# Altium project CHILD_BOARD.PrjPcb
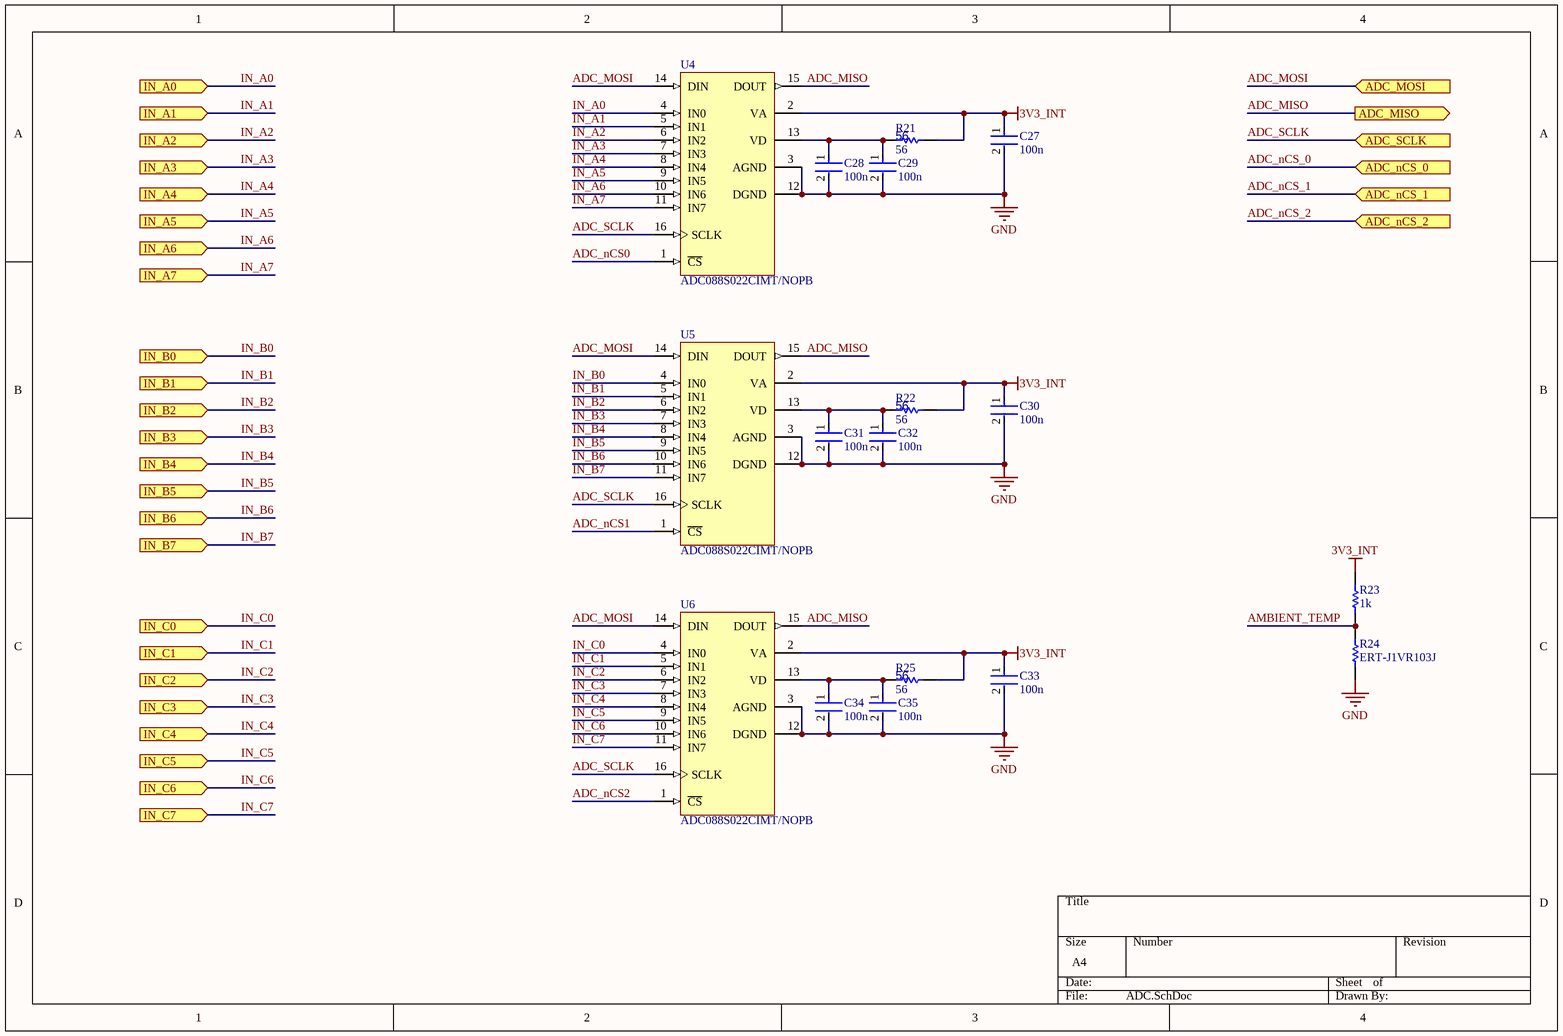
[diagram p0: ADC.SchDoc]
4 sheets, 87 parts. Net scope: flat (ports and power ports of the same name join across sheets).
Board file: CHILD_BOARD_revA.PcbDoc
Sheets:
  ADC.SchDoc
  TCAN1146_PWR_MGMT.SchDoc
  LM74910H_PINOUT.SchDoc
  JETSON_RAW_PWR_FILTER.SchDoc

## Sheet ADC.SchDoc
size A4; SheetNumber: 5; SheetTotal: 11

### Parts
C27  100n  [FP-0402-L_1_0_0_05-W_0_5-IPC_A]
C28  100n  [FP-0402-L_1_0_0_05-W_0_5-IPC_A]
C29  100n  [FP-0402-L_1_0_0_05-W_0_5-IPC_A]
C30  100n  [FP-0402-L_1_0_0_05-W_0_5-IPC_A]
C31  100n  [FP-0402-L_1_0_0_05-W_0_5-IPC_A]
C32  100n  [FP-0402-L_1_0_0_05-W_0_5-IPC_A]
C33  100n  [FP-0402-L_1_0_0_05-W_0_5-IPC_A]
C34  100n  [FP-0402-L_1_0_0_05-W_0_5-IPC_A]
C35  100n  [FP-0402-L_1_0_0_05-W_0_5-IPC_A]
R21  56  [R0603B]
R22  56  [R0603B]
R23  1k  [R0603B]
R24  ERT-J1VR103J  [RESC1608X90X30ML15T20]
R25  56  [R0603B]
U4  ADC088S022CIMT/NOPB  [MTC16_L]
U5  ADC088S022CIMT/NOPB  [MTC16_L]
U6  ADC088S022CIMT/NOPB  [MTC16_L]

### Ports
ADC_MISO (out, see CHILD_BOARD[5A]), ADC_MOSI (in, see CHILD_BOARD[5A]), ADC_nCS_0 (in), ADC_nCS_1 (in, see CHILD_BOARD[5A]), ADC_nCS_2 (in, see CHILD_BOARD[5A]), ADC_SCLK (in, see CHILD_BOARD[5A]), IN_A0 (in), IN_A1 (in), IN_A2 (in), IN_A3 (in), IN_A4 (in), IN_A5 (in), IN_A6 (in), IN_A7 (in), IN_B0 (in), IN_B1 (in), IN_B2 (in), IN_B3 (in), IN_B4 (in), IN_B5 (in), IN_B6 (in), IN_B7 (in), IN_C0 (in), IN_C1 (in), IN_C2 (in), IN_C3 (in), IN_C4 (in), IN_C5 (in), IN_C6 (in), IN_C7 (in)

### Nets
3V3_INT: C27.1 C30.1 C33.1 R21.1 R22.1 R23.2 R25.1 U4.2(VA) U5.2(VA) U6.2(VA)
GND: C27.2 C28.2 C29.2 C30.2 C31.2 C32.2 C33.2 C34.2 C35.2 R24.1 U4.3(AGND) U4.12(DGND) U5.3(AGND) U5.12(DGND) U6.3(AGND) U6.12(DGND)
ADC_MISO: U4.15(DOUT) U5.15(DOUT) U6.15(DOUT) ; port ADC_MISO
ADC_MOSI: U4.14(DIN) U5.14(DIN) U6.14(DIN) ; port ADC_MOSI
ADC_nCS0: U4.1(~{CS})
ADC_nCS1: U5.1(~{CS})
ADC_nCS2: U6.1(~{CS})
ADC_nCS_0: port ADC_nCS_0
ADC_nCS_1: port ADC_nCS_1
ADC_nCS_2: port ADC_nCS_2
ADC_SCLK: U4.16(SCLK) U5.16(SCLK) U6.16(SCLK) ; port ADC_SCLK
AMBIENT_TEMP: R23.1 R24.2
IN_A0: U4.4(IN0) ; port IN_A0
IN_A1: U4.5(IN1) ; port IN_A1
IN_A2: U4.6(IN2) ; port IN_A2
IN_A3: U4.7(IN3) ; port IN_A3
IN_A4: U4.8(IN4) ; port IN_A4
IN_A5: U4.9(IN5) ; port IN_A5
IN_A6: U4.10(IN6) ; port IN_A6
IN_A7: U4.11(IN7) ; port IN_A7
IN_B0: U5.4(IN0) ; port IN_B0
IN_B1: U5.5(IN1) ; port IN_B1
IN_B2: U5.6(IN2) ; port IN_B2
IN_B3: U5.7(IN3) ; port IN_B3
IN_B4: U5.8(IN4) ; port IN_B4
IN_B5: U5.9(IN5) ; port IN_B5
IN_B6: U5.10(IN6) ; port IN_B6
IN_B7: U5.11(IN7) ; port IN_B7
IN_C0: U6.4(IN0) ; port IN_C0
IN_C1: U6.5(IN1) ; port IN_C1
IN_C2: U6.6(IN2) ; port IN_C2
IN_C3: U6.7(IN3) ; port IN_C3
IN_C4: U6.8(IN4) ; port IN_C4
IN_C5: U6.9(IN5) ; port IN_C5
IN_C6: U6.10(IN6) ; port IN_C6
IN_C7: U6.11(IN7) ; port IN_C7
NetC28_1: C28.1 C29.1 R21.2 U4.13(VD)
NetC31_1: C31.1 C32.1 R22.2 U5.13(VD)
NetC34_1: C34.1 C35.1 R25.2 U6.13(VD)

### Library data of the parts
C27-C35 = CMP-001-00058-1: LARGE PADS, 0402 CAP, CHANGE COMMENT TO MATCH REAL P/N; Capacitor Type: Ceramic; Min Operating Temperature: -55°C; Mounting Technology: Surface Mount; Pins: 2; Case/Package: 0402; RoHS Compliant: Yes; Max Operating Temperature: 85°C
R21-R23 R25 = CMP-009-00002-14: Resistor
  R21 R22 R25: Value: 56
  R23: Value: 1k
R24 = CMP-2000-00869-1: Manufacturer: Panasonic; Part Number: ERT-J1VR103J
U4-U6 = CMP-0054-00372-2: 8-Channel, 50 kSPS to 200 kSPS, 8-Bit A/D Converter, 16-pin TSSOP, Pb-Free; Manufacturer: National Semiconductor; PackageTopMarking: NSUZXYTT*88S022*CIMT; CompType: ADC IC; PowerWise: Y; ComponentLink2URL: http://www.national.com/pf/AD/ADC088S022.html; RoHS: Y; PackageDescription: Molded TSSOP, Jedec, 5 x 4.4 x 0.9mm Body, 16 Lead, 0.65mm Pitch; DatasheetVersion: Feb-2010; PinCount: 16; ComponentLink1Description: ADC088S022 Datasheet; Code_JEDEC: MO-153-AB; ComponentLink3URL: http://www.national.com/packaging/folders/mtc16.html; PackageVersion: revD, Jun-2003; ComponentLink3Description: MTC16 Package Page; RevisionNote: Component URLs added; ComponentLink1URL: http://www.national.com/ds/AD/ADC088S022.pdf; ComponentLink2Description: ADC088S022 Web Page; PackageReference: MTC16

## Sheet TCAN1146_PWR_MGMT.SchDoc
size C; SheetNumber: 7; SheetTotal: 11
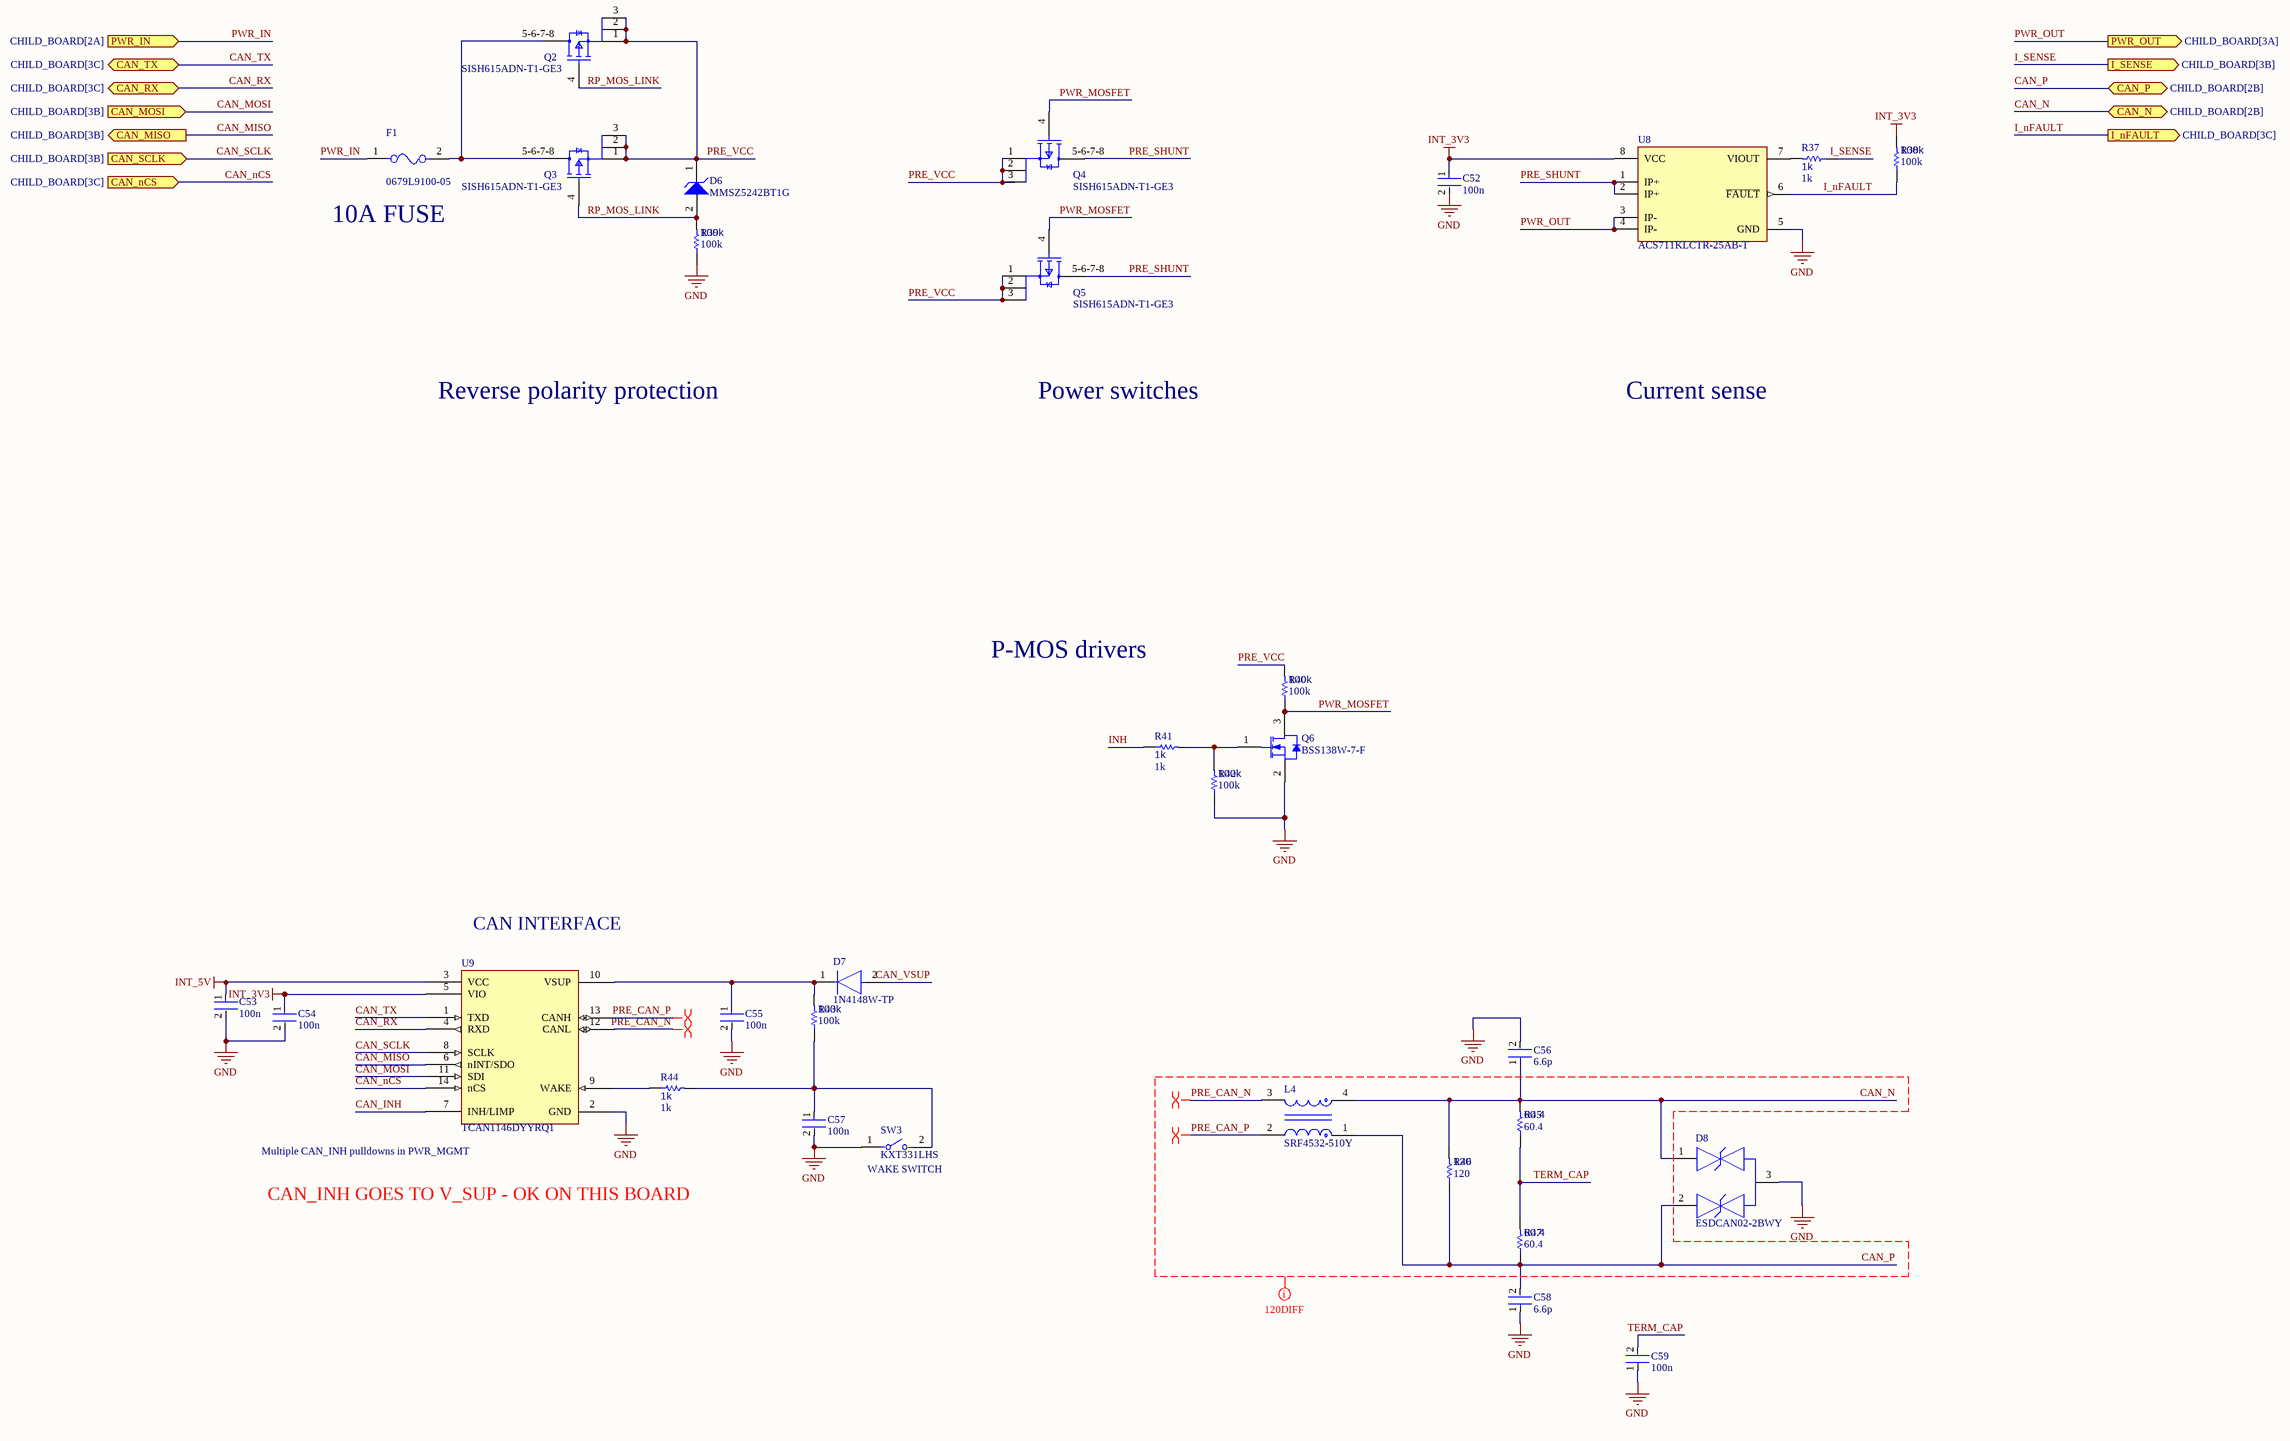
[diagram p1: TCAN1146_PWR_MGMT.SchDoc]

### Parts
C52  100n  [FP-0402-L_1_0_0_05-W_0_5-IPC_A]
C53  100n  [FP-0402-L_1_0_0_05-W_0_5-IPC_A]
C54  100n  [FP-0402-L_1_0_0_05-W_0_5-IPC_A]
C55  100n  [FP-0402-L_1_0_0_05-W_0_5-IPC_A]
C56  6.6p  [FP-0402-L_1_0_0_05-W_0_5-IPC_A]
C57  100n  [FP-0402-L_1_0_0_05-W_0_5-IPC_A]
C58  6.6p  [FP-0402-L_1_0_0_05-W_0_5-IPC_A]
C59  100n  [FP-0402-L_1_0_0_05-W_0_5-IPC_A]
D6  MMSZ5242BT1G  [ONSC-SOD-123-2-425-04_V]
D7  1N4148W-TP  [FP-SOD-123-IPC_A]
D8  ESDCAN02-2BWY  [FP-SOT323-3L-MFG]
F1  0679L9100-05  [FP-0679L-MFG]
L4  SRF4532-510Y  [FP-SRF4532-MFG]
Q2  SISH615ADN-T1-GE3  [SISH615ADN-T1-GE3-Footprint-1]
Q3  SISH615ADN-T1-GE3  [SISH615ADN-T1-GE3-Footprint-1]
Q4  SISH615ADN-T1-GE3  [SISH615ADN-T1-GE3-Footprint-1]
Q5  SISH615ADN-T1-GE3  [SISH615ADN-T1-GE3-Footprint-1]
Q6  BSS138W-7-F  [DIOD-SOT323-3_V]
R37  1k  [R0603B]
R38  100k  [R0603B]
R39  100k  [R0603B]
R40  100k  [R0603B]
R41  1k  [R0603B]
R42  100k  [R0603B]
R43  100k  [R0603B]
R44  1k  [R0603B]
R45  60.4  [R0603B]
R46  120  [R0603B]
R47  60.4  [R0603B]
SW3  KXT331LHS  [FP-KXT331LHS-MFG]
U8  ACS711KLCTR-25AB-T  [FP-LC-8-IPC_A]
U9  TCAN1146DYYRQ1  [TCAN1146DYYRQ1-Footprint-1]

### Ports
CAN_MISO (out, see CHILD_BOARD[3B]), CAN_MOSI (in, see CHILD_BOARD[3B]), CAN_N (bidir, see CHILD_BOARD[2B]), CAN_nCS (in, see CHILD_BOARD[3C]), CAN_P (bidir, see CHILD_BOARD[2B]), CAN_RX (bidir, see CHILD_BOARD[3C]), CAN_SCLK (in, see CHILD_BOARD[3B]), CAN_TX (bidir, see CHILD_BOARD[3C]), I_nFAULT (out, see CHILD_BOARD[3C]), I_SENSE (out, see CHILD_BOARD[3B]), PWR_IN (in, see CHILD_BOARD[2A]), PWR_OUT (out, see CHILD_BOARD[3A])

### Nets
GND: C52.2 C53.2 C54.2 C55.2 C56.2 C57.2 C58.1 C59.1 D8.3 Q6.2(S) R39.1 R42.1 SW3.1 U8.5(GND) U9.2(GND)
INT_3V3: C52.1 C54.1 R38.2 U8.8(VCC) U9.5(VIO)
INT_5V: C53.1 U9.3(VCC)
CAN_INH: U9.7(INH/LIMP)
CAN_MISO: U9.6(nINT/SDO) ; port CAN_MISO
CAN_MOSI: U9.11(SDI) ; port CAN_MOSI
CAN_N: C56.1 D8.1 L4.4 R45.2 R46.2 ; port CAN_N
CAN_nCS: U9.14(nCS) ; port CAN_nCS
CAN_P: C58.2 D8.2 L4.1 R46.1 R47.1 ; port CAN_P
CAN_RX: U9.4(RXD) ; port CAN_RX
CAN_SCLK: U9.8(SCLK) ; port CAN_SCLK
CAN_TX: U9.1(TXD) ; port CAN_TX
CAN_VSUP: D7.2(A)
I_nFAULT: R38.1 U8.6(~{FAULT}) ; port I_nFAULT
I_SENSE: R37.1 ; port I_SENSE
INH: R41.1
PRE_CAN_N: L4.3 U9.12(CANL)
PRE_CAN_P: L4.2 U9.13(CANH)
PRE_SHUNT: Q4.5-6-7-8(D) Q5.5-6-7-8(D) U8.1(IP+) U8.2(IP+)
PRE_VCC: D6.1(K) Q2.1(S) Q2.2(S) Q2.3(S) Q3.1(S) Q3.2(S) Q3.3(S) Q4.1(S) Q4.2(S) Q4.3(S) Q5.1(S) Q5.2(S) Q5.3(S) R40.2
PWR_IN: F1.1 ; port PWR_IN
PWR_MOSFET: Q4.4(G) Q5.4(G) Q6.3(D) R40.1
PWR_OUT: U8.3(IP-) U8.4(IP-) ; port PWR_OUT
RP_MOS_LINK: D6.2(A) Q2.4(G) Q3.4(G) R39.2
TERM_CAP: C59.2 R45.1 R47.2
NetC55_1: C55.1 D7.1(C) R43.2 U9.10(VSUP)
NetC57_1: C57.1 R43.1 R44.2 SW3.2
NetF1_2: F1.2 Q2.5-6-7-8(D) Q3.5-6-7-8(D)
NetQ6_1: Q6.1(G) R41.2 R42.2
NetR37_2: R37.2 U8.7(VIOUT)
NetR44_1: R44.1 U9.9(WAKE)

### Layout directives
differential pair: PRE_CAN_N, PRE_CAN_P
net class 120DIFF: CAN_N, CAN_P, PRE_CAN_N, PRE_CAN_P, TERM_CAP

### Notes on the sheet
- (near F1) 10A FUSE
- Reverse polarity protection
- Power switches
- Current sense
- P-MOS drivers
- CAN INTERFACE
- (near U9) Multiple CAN_INH pulldowns in PWR_MGMT
- (near SW3) WAKE SWITCH
- CAN_INH GOES TO V_SUP - OK ON THIS BOARD

### Library data of the parts
C52-C59 = CMP-001-00058-1: as C27 on sheet ADC; Min Operating Temperature: -55°C; Mounting Technology: Surface Mount; Pins: 2; Case/Package: 0402; RoHS Compliant: Yes; Max Operating Temperature: 85°C
D6 = CMP-1060-00565-1: Zener Voltage Regulator, 500 mW, 2-Pin SOD-123, Pb-Free, Tape and Reel; Manufacturer: On Semiconductor; P Max (W): 0.5; VZ Typ (V): 12; PartNumber: MMSZ5242BT1G; PackageReference: SOD-123-2-425-04; ComponentLink3URL: http://www.onsemi.com/pub_link/Collateral/425-04.PDF; Mounting Technology: Surface Mount; ComponentLink2Description: Datasheet; ComponentLink1URL: http://www.onsemi.com/; ComponentLink3Description: Package Specification; PackageDescription: 2-Pin SOD, Body 1.6 x 2.69 mm; PackageVersion: Rev. G, 10/2009; ComponentLink1Description: Manufacturer URL; RoHS: Pb-Free; ComponentLink2URL: http://www.onsemi.com/pub_link/Collateral/MMSZ5221BT1-D.PDF; Packing: Tape and Reel; DatasheetVersion: Rev. 12
D7 = CMP-2000-04993-2: DIODE GEN PURP 100V 150MA SOD123; Max Reverse Leakage Current: 5uA; Max Surge Current: 2A; Reverse Recovery Time: 4ns; Polarity: Standard; Capacitance: 4pF; Max Forward Surge Current (Ifsm): 1A; Element Configuration: Single; Power Dissipation: 400mW; Forward Voltage: 1V; Radiation Hardening: No; Lead Free: Lead Free; Max Reverse Voltage (DC): 100V; Current Rating: 150mA; Forward Current: 150mA; Packaging: Tape and Reel; Number of Pins: 2; Package Quantity: 3000; Max Operating Temperature: 150°C; Min Operating Temperature: -65°C; Average Rectified Current: 150mA; Recovery Time: 4ns; Output Current: 150mA; Peak Non-Repetitive Surge Current: 2A; Width: 1.8mm; Voltage Rating (DC): 100V; Height: 1.2mm; Max Repetitive Reverse Voltage (Vrrm): 100V; Mount: Surface Mount; Length: 2.85mm
D8 = CMP-12225-000055-1: TVS DIODE 26.5V 44V SOT323-3; Manufacturer: STMicroelectronics; Value: 3pF; Direction: Bidirectional; Breakdown Voltage: 28.5V; Automotive Grade: Grade 0; Standoff Height: 0mm; Peak Pulse Power: 170W; Peak Pulse Current: 3A; Number Of Channels: 2; Max Junction Temp: +175°C; Mouser Description: TVS Diodes / ESD Suppressors Automotive dual-line Transil, Transient voltage suppressor (TVS) for CAN bus; Height: 1.1mm; Category: Diode; Reverse Standoff Voltage: 26.5V; Device Class L1: Circuit Protection; Temperature: -55°C to +175°C; RoHS: TRUE; ComponentLink2URL: https://www.st.com/resource/en/datasheet/esdcan02-2bwy.pdf; Device Class L3: unset; Device Class L2: TVS Diodes; Temperature Range High: +175°C; Octopart: https://octopart.com/esdcan02-2bwy-stmicroelectronics-58631133; Ipc Land Pattern Name: SOT65P210X95-3; Temperature Range Low: -55°C; Capacitance: 3pF; Digikey Description: TVS DIODE 26.5V 44V SOT323-3; Automotive: Yes; ComponentLink2Description: Datasheet; Clamping Voltage: 44V; Manufacturer Part Number: ESDCAN02-2BWY; Lead Free: Yes; Package: SOT323-3L
F1 = CMP-16042-000002-1: DIFF P#!!! / FUSE BRD MNT 10A 125VAC/VDC; Manufacturer: Bel Fuse; Manufacturer Part Number: 0679L9150-01; Max Fuse Ac Voltage: 125V; Fuse Blow Speed: Fast; Fuse Current: 15A; Fuse I2T: 103.5A2Sec; Fuse Interrupt Ac Current: 50A; Automotive Grade: Grade 1; Value: 0.0038Ω; Fuse Interrupt Dc Current: 300A; Fuse Voltage Drop: 0.13V; Device Class L2: Fuses; ComponentLink2URL: https://www.belfuse.com/resources/CircuitProtection/datasheets/0679L%20Sep2016.pdf; Package: 0679L; Height: 2.79mm; Digikey Description: FUSE BRD MNT 15A 125VAC/VDC; Temperature Range High: +125°C; Device Class L3: unset; Octopart: https://octopart.com/0679l9150-01-bel+fuse-70850665; Temperature Range Low: -55°C; Max Fuse Dc Voltage: 125V; Ipc Land Pattern Name: CAPC610254X254; Category: Fuse; Lead Free: Yes; Automotive: Yes; Resistance: 0.0038Ω; RoHS: TRUE; Device Class L1: Circuit Protection; ComponentLink2Description: Datasheet; Temperature: -55°C to +125°C; Voltage Rating: 125V
L4 = CMP-07251-000006-1: CMC 51UH 200MA 2LN 2KOHM SMD; Element Configuration: Dual; Number of Lines: 2; Core Material: Ferrite; Impedance: 2kR; Test Frequency: 100kHz; Voltage Rating (DC): 50V; Insulation Resistance: 10MR; Material: Steel; Tolerance: 50%; DC Resistance (DCR): 3.5R; RoHS Compliant: Yes; Mount: Surface Mount; REACH SVHC: No SVHC; Termination: SMD/SMT; DC Current: 200mA; Current: 200mA; Lead Free: Lead Free; Contact Plating: Tin; Length: 4.5mm; Max DC Current: 200mA; Width: 0.126inch; Case/Package: 4532; Packaging: Tape and Reel; Package Quantity: 1; Min Operating Temperature: -40°C; Depth: 3.4mm; Series: SRF4532; Max Operating Temperature: 125°C; Current Rating: 200mA; Self Resonant Frequency: 100kHz; Height: 0.118inch; Inductance: 51uH; Resistance: 2kR
Q2-Q5 = CMP-013-00018-2: Trans MOSFET P-CH 20V 22.1A 8-Pin PowerPAK 1212 EP T/R; Source: SISH615ADN-T1-GE3.SchLib; Design Item ID: CMP-013-00036-4; Component Type: Standard; Pins: 5
Q6 = CMP-2000-05968-1: N-Channel Enhancement Mode Mosfet, 50 V, 200 mA, -55 to 150 degC, 6-Pin SOT-323, RoHS, Tape and Reel; Typical Turn-Off Delay Time: 20ns; Number of Channels: 1Channel; Type: EnhancementModeFieldEffectTransistor; Brand: DiodesIncorporated; Vds - Drain-Source Breakdown Voltage: 75V; Vgs - Gate-Source Voltage: 20V; Rds On - Drain-Source Resistance: 1.4Ohms; Transistor Type: 1N-Channel; Configuration: Single; Unit Weight: 0.000212oz; Pd - Power Dissipation: 200mW; Id - Continuous Drain Current: 200mA; Forward Transconductance - Min: 0.1S; Manufacturer URL: http://www.diodes.com/; Series: BSS138; Package Description: 3-Pin Small Outline Transistor, Body 2 x 1.25 mm, Pitch 0.65 mm; Mounting Technology: SurfaceMount; Product Category: MOSFET; RoHS: True; Maximum Operating Temperature: +150C; Height: 1mm; Length: 2.2mm; Technology: Si; Width: 1.35mm; Datasheet URL: http://www.diodes.com/_files/datasheets/ds30206.pdf; Manufacturer: DiodesIncorporated; Package / Case: SOT-323-3; Typical Turn-On Delay Time: 20ns; Transistor Polarity: N-Channel; Factory Pack Quantity: 3000; Packaging: Reel; Product: MOSFETSmallSignal; Datasheet Version: Rev. 11-2, 09/2013; Package Reference: SOT323; Minimum Operating Temperature: -55C; Mounting Style: SMD/SMT; Channel Mode: Enhancement
R37-R47 = CMP-009-00002-14: Resistor
  R37 R41 R44: Value: 1k
  R38-R40 R42 R43: Value: 100k
  R45 R47: Value: 60.4
  R46: Value: 120
SW3 = CMP-10040-000029-1: SWITCH TACTILE SPST-NO 0.02A 15V; Operating Force: 240gf; Switch Travel: 0.13mm; Illumination Type: Non-Illuminated; Throw Configuration: SPST; Number of Ports: 1; Current Rating: 5A; Mechanical Life: 500000Cycles; Switch Function: Off-Mom; Connector Type: USB; Actuator Type: Standard; Gender: Receptacle; Number of Contacts: 24; Contact Plating: Gold; Insulation Color: Black; Min Operating Temperature: -40°C; Packaging: Tape and Reel; Flammability Rating: UL94 V-0; Max Operating Temperature: 85°C; Termination: Solder; Mount: Surface Mount
U8 = CMP-1557-00015-2: SENSOR CURRENT HALL 25A AC/DC; Bandwidth: 100kHz; Min Supply Voltage: 3V; Polarity: Bidirectional; Max Supply Voltage: 5.5V; Max Supply Current: 5.5mA; Number of Channels: 1; Quiescent Current: 4mA; Sensitivity: 55mV/A; Accuracy: 4%; Linearity: 1%; Operating Supply Voltage: 3.3V; Response Time: 4.6us; Case/Package: SOIC; Min Operating Temperature: -40°C; RoHS Compliant: Yes; Length: 4.9mm; Package Quantity: 1; Number of Pins: 8; Width: 3.9mm; REACH SVHC: No SVHC; -3db Bandwidth: 100kHz; Series: -; Packaging: Tape and Reel; Max Operating Temperature: 125°C; Current Sensing: 25A; Height: 1.5mm; Frequency: 100kHz
U9 = CMP-318-000000-2: Automotive CAN FD transceiver with watchdog, bus diagnostics and partial networking via sele 14-SOT-23-THIN -40 to 150; Component Type: Standard; Design Item ID: CMP-015-00012-2; Pin Count: 14; Source: TCAN1146DYYRQ1.SchLib

## Sheet LM74910H_PINOUT.SchDoc
size B; SheetNumber: 9; SheetTotal: 11
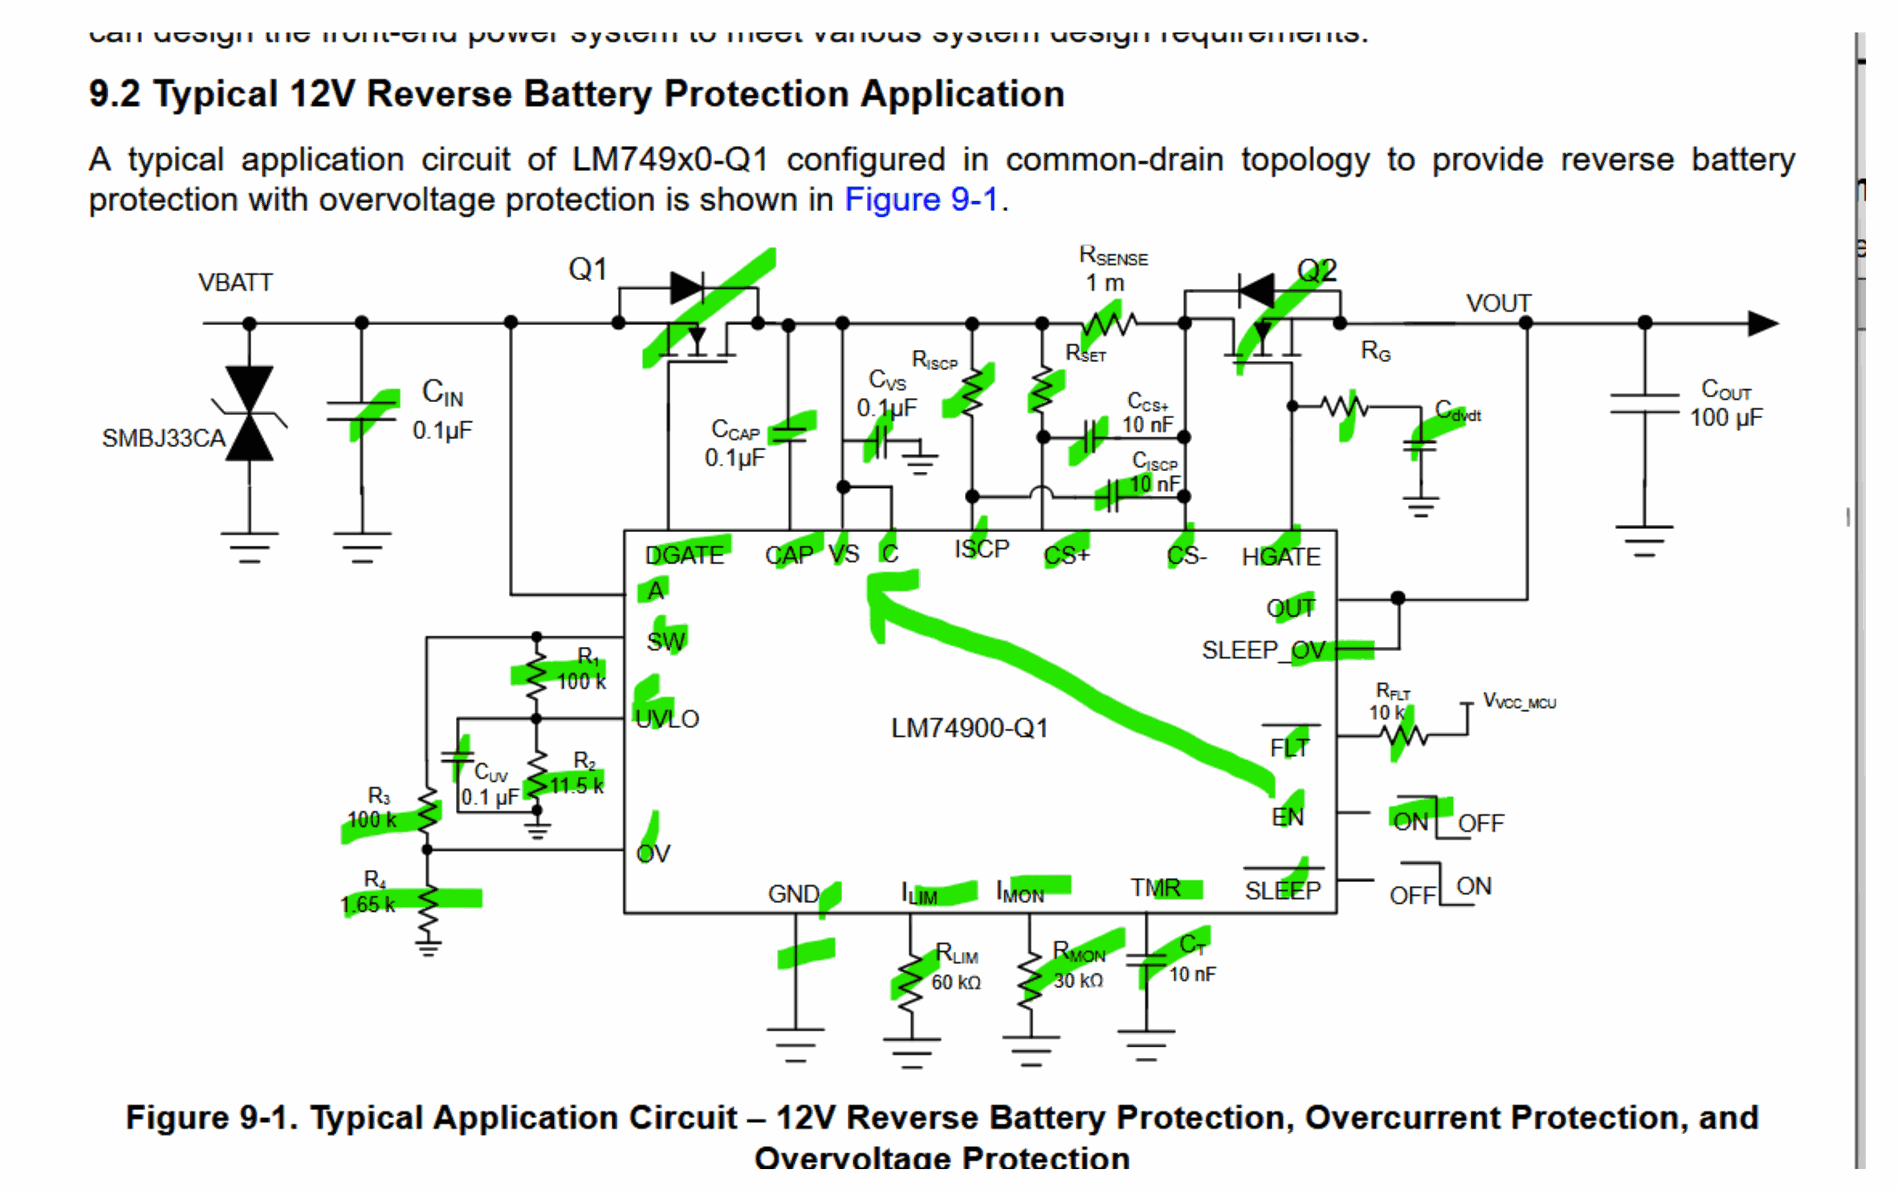
[diagram p2: LM74910H_PINOUT.SchDoc, top]
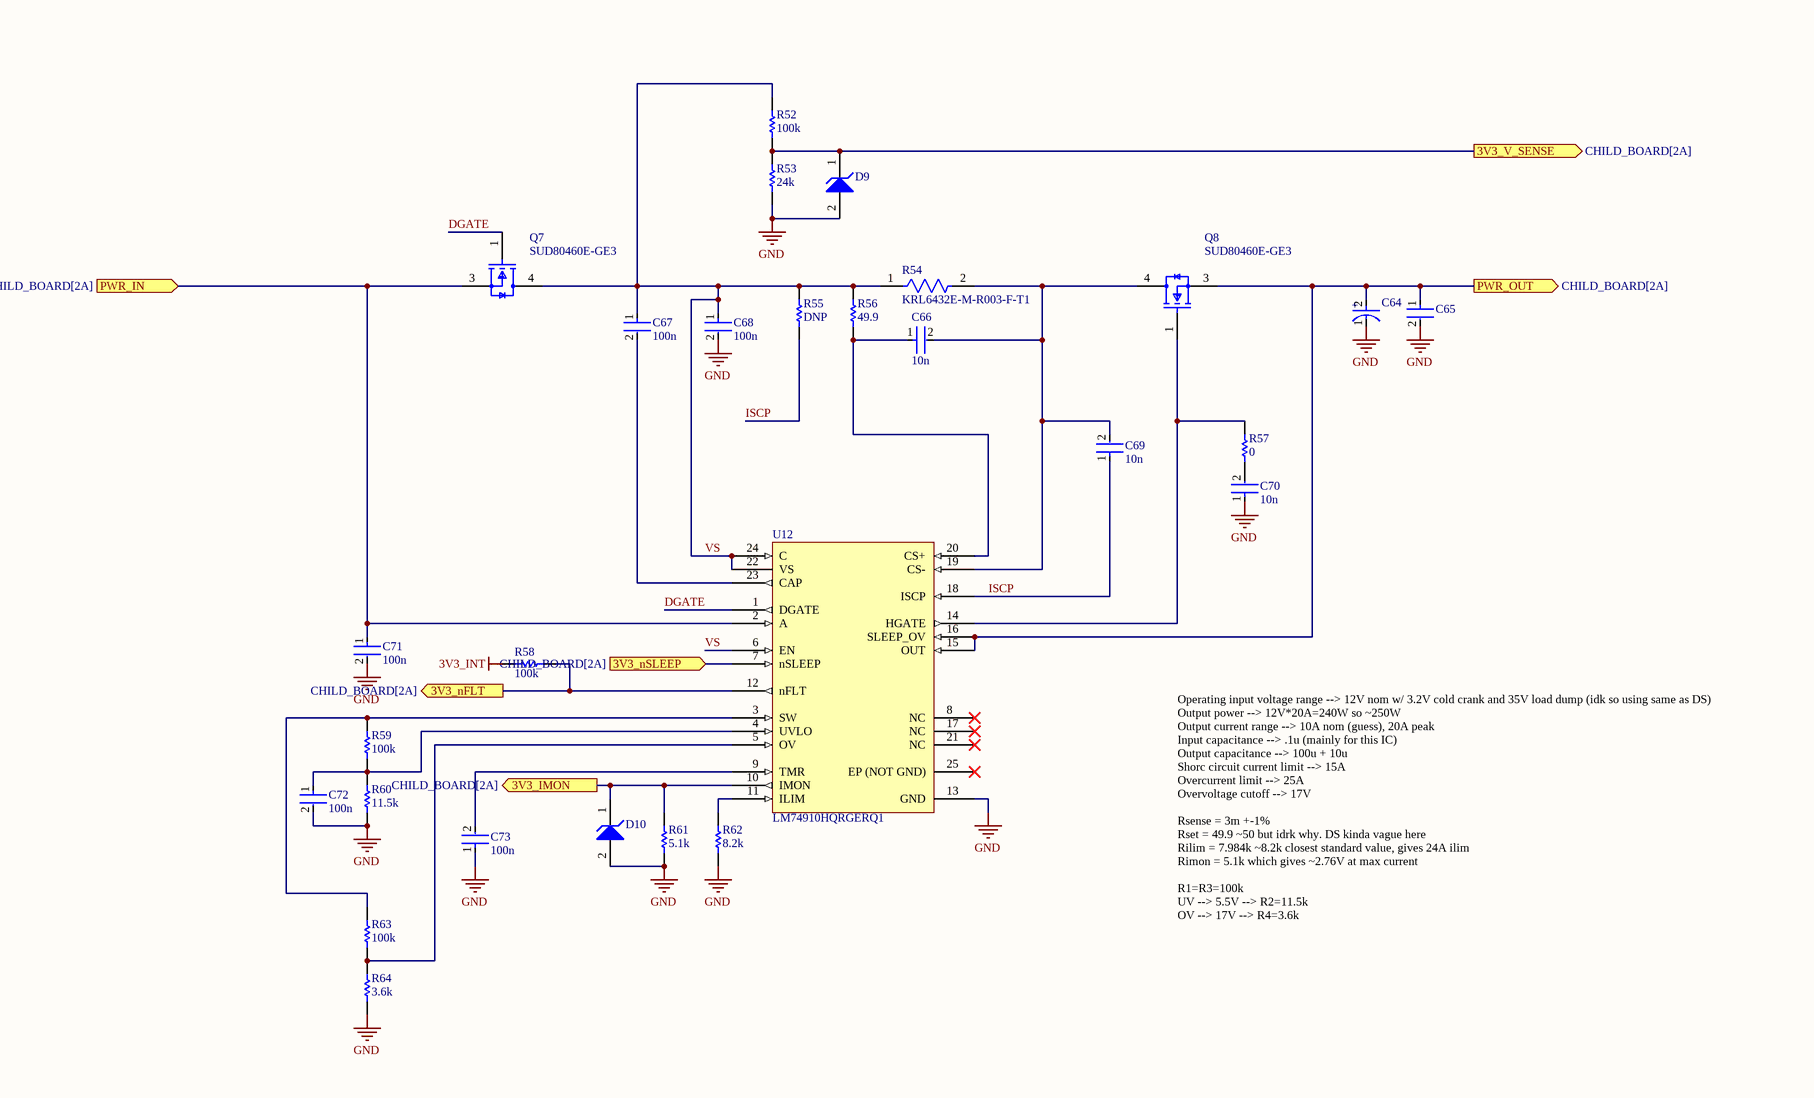
[diagram p3: LM74910H_PINOUT.SchDoc, bottom]

### Parts
C64  EEE-FK1H100UR  [FP-FKC-MFG]  (value not drawn)
C65  12103D106KAT2A  [FP-1210-L_3_3_0_4-W_2_5_0-MFG]  (value not drawn)
C66  10n  [FP-0402-L_1_0_0_05-W_0_5-IPC_A]
C67  100n  [FP-0402-L_1_0_0_05-W_0_5-IPC_A]
C68  100n  [FP-0402-L_1_0_0_05-W_0_5-IPC_A]
C69  10n  [FP-0402-L_1_0_0_05-W_0_5-IPC_A]
C70  10n  [FP-0402-L_1_0_0_05-W_0_5-IPC_A]
C71  100n  [FP-0402-L_1_0_0_05-W_0_5-IPC_A]
C72  100n  [FP-0402-L_1_0_0_05-W_0_5-IPC_A]
C73  100n  [FP-0402-L_1_0_0_05-W_0_5-IPC_A]
D9  DNP/MM5Z3V3T1G  [ONSC-SOD-523-2-502-01_V]  (value not drawn)
D10  DNP/MM5Z3V3T1G  [ONSC-SOD-523-2-502-01_V]  (value not drawn)
Q7  SUD80460E-GE3  [FP-T16-0236-MFG]
Q8  SUD80460E-GE3  [FP-T16-0236-MFG]
R52  100k  [R0603B]
R53  24k  [R0603B]
R54  KRL6432E-M-R003-F-T1  [FP-KRL6432E-MFG]
R55  DNP  [R0603B]
R56  49.9  [R0603B]
R57  0  [R0603B]
R58  100k  [R0603B]
R59  100k  [R0603B]
R60  11.5k  [R0603B]
R61  5.1k  [R0603B]
R62  8.2k  [R0603B]
R63  100k  [R0603B]
R64  3.6k  [R0603B]
U12  LM74910HQRGERQ1  [QFN50P400X400X100_HS-25N]

### Ports
3V3_IMON (out, see CHILD_BOARD[2A]), 3V3_nFLT (out, see CHILD_BOARD[2A]), 3V3_nSLEEP (in, see CHILD_BOARD[2A]), 3V3_V_SENSE (out, see CHILD_BOARD[2A]), PWR_IN (in, see CHILD_BOARD[2A]), PWR_OUT (out, see CHILD_BOARD[2A])

### Nets
3V3_INT: R58.2
GND: C64.1(C) C65.2 C68.2 C70.1 C71.2 C72.2 C73.1 D9.2(A) D10.2(A) R53.1 R60.1 R61.1 R62.1 R64.1 U12.13(GND)
DGATE: Q7.1(G) U12.1(DGATE)
ISCP: C69.1 R55.1 U12.18(ISCP)
PWR_IN: C71.1 Q7.3(S) U12.2(A) ; port PWR_IN
PWR_OUT: C64.2(A) C65.1 Q8.3(S) U12.15(OUT) U12.16(SLEEP_OV) ; port PWR_OUT
VS: C67.1 C68.1 Q7.4(D) R52.2 R54.1 R55.2 R56.2 U12.6(EN) U12.22(VS) U12.24(C)
NetC66_1: C66.1 R56.1 U12.20(CS+)
NetC66_2: C66.2 C69.2 Q8.4(D) R54.2 U12.19(CS-)
NetC67_2: C67.2 U12.23(CAP)
NetC70_2: C70.2 R57.1
NetC72_1: C72.1 R59.1 R60.2 U12.4(UVLO)
NetC73_2: C73.2 U12.9(TMR)
NetD9_1: D9.1(K) R52.1 R53.2 ; port 3V3_V_SENSE
NetD10_1: D10.1(K) R61.2 U12.10(IMON) ; port 3V3_IMON
NetQ8_1: Q8.1(G) R57.2 U12.14(HGATE)
NetR58_1: R58.1 U12.12(nFLT) ; port 3V3_nFLT
NetR59_2: R59.2 R63.2 U12.3(SW)
NetR62_2: R62.2 U12.11(ILIM)
NetR63_1: R63.1 R64.2 U12.5(OV)
NetU12_7: U12.7(nSLEEP) ; port 3V3_nSLEEP

Not connected (* = marked no-connect by the designer): U12 8(NC)* 17(NC)* 21(NC)* 25(EP_(NOT_GND))*

### Notes on the sheet
- Operating input voltage range --> 12V nom w/ 3.2V cold crank and 35V load dump (idk so using same as DS)
  Output power --> 12V*20A=240W so ~250W
  Output current range --> 10A nom (guess), 20A peak
  Input capacitance --> .1u (mainly for this IC)
  Output capacitance --> 100u + 10u
  Shorc circuit current limit --> 15A
  Overcurrent limit --> 25A
  Overvoltage cutoff --> 17V
  Rsense = 3m +-1%
  Rset = 49.9 ~50 but idrk why. DS kinda vague here
  Rilim = 7.984k ~8.2k closest standard value, gives 24A ilim
  Rimon = 5.1k which gives ~2.76V at max current
  R1=R3=100k
  UV --> 5.5V --> R2=11.5k
  OV --> 17V --> R4=3.6k
- (in symbol CMP-05427-000030-1) +

### Library data of the parts
C64 = CMP-05427-000030-1: CAP ALUM 10UF 20% 50V SMD; Impedance: 1.52R; Ripple Current (AC): 85mA; Life (Hours): 2000Hour; Leakage Current: 3uA; Dielectric Material: Aluminium; Length: 5.8mm; Voltage Rating: 50V; Radiation Hardening: No; Max Operating Temperature: 105°C; REACH SVHC: No SVHC; Tolerance: 20%; RoHS Compliant: Yes; Case/Package: Radial; Height: 5.8mm; Voltage: 50V; Diameter: 5mm; Number of Pins: 2; Ripple Current: 85mA; Series: FK; Lead Free: Lead Free; Width: 6.5mm; ESR (Equivalent Series Resistance): 1.52R; Package Quantity: 1000; Construction: Cylindrical; Voltage Rating (DC): 50V; Packaging: Tape and Reel; Height - Seated (Max): 0.228inch; Contact Plating: Tin; Capacitance: 10uF; Min Operating Temperature: -55°C; Termination: SMD/SMT; Material: Aluminium; Mount: Surface Mount
C65 = CMP-2000-05477-2: General Purpose Ceramic Capacitor, 1210, 10uF, 10%, X5R, 15%, 25V; Lead Free: Lead Free; Max Operating Temperature: 85°C; REACH SVHC: No SVHC; Depth: 2.5mm; Packaging: Tape and Reel; Min Operating Temperature: -55°C; Height: 2.29mm; Construction: Flat; Case Code (Imperial): 1210; Radiation Hardening: No; Voltage: 25V; Case/Package: 1210; Series: -; Dielectric: X5R; Length: 3.2mm; Thickness: 0.11inch; Package Quantity: 1; Termination: SMD/SMT; Case Code (Metric): 3225; Voltage Rating (DC): 25V; Voltage Rating: 25V; Contact Plating: Tin; RoHS Compliant: Yes; Mount: Surface Mount; Width: 0.098inch; Capacitance: 10uF; Tolerance: 10%
C66-C73 = CMP-001-00058-1: as C27 on sheet ADC; Min Operating Temperature: -55°C; Mounting Technology: Surface Mount; Pins: 2; Case/Package: 0402; RoHS Compliant: Yes; Max Operating Temperature: 85°C
D9 D10 = CMP-1060-00750-1: Zener Voltage Regulator, 500 mW, 2-Pin SOD-523, Pb-Free, Tape and Reel; Manufacturer: On Semiconductor; P Max (W): 0.5; VZ Typ (V): 3.3; RoHS: Pb-Free; ComponentLink2Description: Datasheet; PackageReference: SOD-523-2-502-01; DatasheetVersion: Rev. 10; ComponentLink1Description: Manufacturer URL; PackageVersion: Rev. E, 09/2010; ComponentLink3URL: http://www.onsemi.com/pub_link/Collateral/502-01.PDF; ComponentLink2URL: http://www.onsemi.cn/pub_link/Collateral/MM5Z2V4T1-D.PDF; Mounting Technology: Surface Mount; PartNumber: MM5Z3V3T1G; Packing: Tape and Reel; PackageDescription: 2-Pin SOD, Body 1.2 x 0.8 mm; ComponentLink1URL: http://www.onsemi.com/; ComponentLink3Description: Package Specification
Q7 Q8 = CMP-02550-000179-1: MOSFET N-CH 150V 42A TO252AA; Manufacturer: Vishay; Rthja Max: 50°C/W; Number Of N Channels: 1; Max Junction Temp: +175°C; Power Dissipation: 65.2W; Reverse Recovery Charge: 210nC; Reverse Recovery Time: 68ns; Threshold Vgs Max: 4V; Input Capacitace At Vds: 560pF @ 50V; Drain To Source Resistance: 0.0372Ω; Max Forward Diode Voltage: 1.5V; Gate Charge At Vgs: 10.5nC @ 10V; Threshold Vgs Min: 2V; Transconductance: 11S; Typ Forward Diode Voltage: 0.85V; Turn On Delay Time: 8ns; Turn Off Delay Time: 15ns; Gate To Source Voltage: 20V; Depletion Mode: False; Pulse Drain Current: 40A; Automotive: No; Drain To Source Voltage: 150V; ComponentLink2Description: Datasheet; Octopart: https://octopart.com/sud80460e-ge3-vishay-78440626; Device Class L2: Transistors; Lead Free: Yes; Device Class L3: MOSFETs; Temperature Range High: +175°C; Continuous Drain Current: 42A; Temperature: -55°C to +175°C; Footprint Url: https://www.vishay.com/docs/71197/to252aa.pdf; Manufacturer Part Number: SUD80460E-GE3; Package: T16-0236; ComponentLink2URL: https://www.vishay.com/docs/76248/sud80460e.pdf; Device Class L1: Discrete Semiconductors; Digikey Description: MOSFET N-CH 150V 42A TO252AA; Number Of Channels: 1; Category: Trans; Temperature Range Low: -55°C; Height: 2.507mm; RoHS: TRUE; Drain To Source Breakdown Voltage: 150V
R52 R53 R55-R64 = CMP-009-00002-14: Resistor
R54 = CMP-00597-24927456-1: KRL6432E-M-R003-F-T1 Metal Foil Low Resistance Chip Resistor (long-side terminal), 2512, RoHS; Tolerance: 1%; Resistance: 3mΩ; Temperature Coefficient: 50ppm/°C; Power Rating: 3W; Height: 700µm; NexarPartId: 24927456; Termination: SMD/SMT; Case Code (Metric): 6432; Min Operating Temperature: -55°C; Length: 3.1mm; Weight: 40.511469mg; Width: 6.3mm; Lifecycle Status: Production; Max Operating Temperature: 155°C; Case Code (Imperial): 2512; Composition: Metal Foil; Case/Package: 2512; Max Thickness: 700µm; RoHS: Compliant
U12 = CMP-019-00057-1: Automotive ideal diode with circuit breaker, 200-kHz ACS, UV , OV protection and SLEEP mode 24-VQFN -40 to 125; Pins: 24; Case/Package: VQFN

## Sheet JETSON_RAW_PWR_FILTER.SchDoc
size A; SheetNumber: 11; SheetTotal: 11
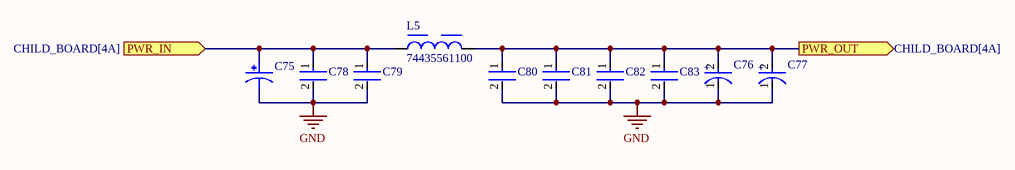
[diagram p4: JETSON_RAW_PWR_FILTER.SchDoc]

### Parts
C75  MAL215099913E3  [MAL215099913E3-Footprint-1]  (value not drawn)
C76  T491X107K025AT  [FP-T491X107K025AT-MFG]  (value not drawn)
C77  T491X107K025AT  [FP-T491X107K025AT-MFG]  (value not drawn)
C78  CGA9P3X7S2A156M250KB  [FP-CGA9P-IPC_B]  (value not drawn)
C79  CGA9P3X7S2A156M250KB  [FP-CGA9P-IPC_B]  (value not drawn)
C80  12103D106KAT2A  [FP-1210-L_3_3_0_4-W_2_5_0-MFG]  (value not drawn)
C81  12103D106KAT2A  [FP-1210-L_3_3_0_4-W_2_5_0-MFG]  (value not drawn)
C82  12103D106KAT2A  [FP-1210-L_3_3_0_4-W_2_5_0-MFG]  (value not drawn)
C83  12103D106KAT2A  [FP-1210-L_3_3_0_4-W_2_5_0-MFG]  (value not drawn)
L5  74435561100  [WE-HCI_1890]

### Ports
PWR_IN (in, see CHILD_BOARD[4A]), PWR_OUT (out, see CHILD_BOARD[4A])

### Nets
GND: C75.2 C76.1(C) C77.1(C) C78.2 C79.2 C80.2 C81.2 C82.2 C83.2
PWR_IN: C75.1 C78.1 C79.1 L5.1 ; port PWR_IN
PWR_OUT: C76.2(A) C77.2(A) C80.1 C81.1 C82.1 C83.1 L5.2 ; port PWR_OUT

### Notes on the sheet
- (in symbol CMP-2000-07204-2) +

### Library data of the parts
C75 = CMP-001-00064-1: Aluminum Electrolytic Capacitor, Polarized, Aluminum (wet), 100V, 20% +Tol, 20% -Tol, 470uF, Surface Mount, 7171; Value: 470µF; Capacitor Type: Aluminium; RoHS Compliant: Yes; Case/Package: 7171; Pins: 2; Max Operating Temperature: 105°C; Min Operating Temperature: -40°C
C76 C77 = CMP-2000-07204-2: CAP TANT 100UF 10% 25V 2917; Leakage Current: 25uA; Ripple Current: 742mA; Polarity: Polar; Dissipation Factor: 8%; Life (Hours): 2000Hour; Dielectric Material: Tantalum; ESR (Equivalent Series Resistance): 300mR; Length: 7.3mm; RoHS Compliant: No; Failure Rate: 0.001%; REACH SVHC: No SVHC; Tolerance: 10%; Mount: Surface Mount; Height - Seated (Max): 0.169inch; Features: General Purpose; Height: 4mm; Package Quantity: 1; Case Code (Metric): 7343; Max Operating Temperature: 125°C; Number of Pins: 2; Radiation Hardening: No; Lead Free: Lead Free; Capacitance: 100uF; Termination: SMD/SMT; Voltage Rating: 25V; Series: T491; Depth: 4.3mm; Construction: Flat; Case/Package: 2917; Min Operating Temperature: -55°C; Voltage Rating (DC): 25V; Width: 4.3mm; Packaging: Tape and Reel; Case Code (Imperial): 2917; Voltage: 25V
C78 C79 = CMP-2000-07446-2: Cap Ceramic 15uF 100V X7S 20% Pad SMD 2220 +125°C Automotive T/R; Thickness: 0.098inch; Weight: 0.016932oz; Depth: 5mm; Min Operating Temperature: -55°C; Composition: Ceramic; Voltage Rating: 100V; Capacitance: 15uF; Package Quantity: 1; Width: 0.197inch; Max Operating Temperature: 125°C; Voltage Rating (DC): 100V; Case Code (Metric): 5750; Tolerance: 20%; Length: 5.7mm; Height: 2.3mm; Mount: Surface Mount; Dielectric: X7S; Termination: SMD/SMT; Case/Package: 2220; Case Code (Imperial): 2220; Packaging: Tape and Reel; Lead Free: Lead Free; Ratings: AEC-Q200; REACH SVHC: No SVHC
C80-C83 = CMP-2000-05477-2: as C65 on sheet LM74910H_PINOUT; Lead Free: Lead Free; Max Operating Temperature: 85°C; REACH SVHC: No SVHC; Depth: 2.5mm; Packaging: Tape and Reel; Min Operating Temperature: -55°C; Height: 2.29mm; Construction: Flat; Case Code (Imperial): 1210; Radiation Hardening: No; Voltage: 25V; Case/Package: 1210; Series: -; Dielectric: X5R; Length: 3.2mm; Thickness: 0.11inch; Package Quantity: 1; Termination: SMD/SMT; Case Code (Metric): 3225; Voltage Rating (DC): 25V; Voltage Rating: 25V; Contact Plating: Tin; RoHS Compliant: Yes; Mount: Surface Mount; Width: 0.098inch; Capacitance: 10uF; Tolerance: 10%
L5 = CMP-0226-00001-2: NexarPartId: 22803350; Inductance Tolerance: 20%; DC Resistance (DCR): 6.9mΩ; Inductance: 10µH; Saturation Current: 10A; Self Resonant Frequency: 14MHz; Width: 18.2mm; Packaging: Cut Tape (CT); Max Operating Temperature: 150°C; Number of Pins: 2; Length: 18.3mm; Min Operating Temperature: -40°C; RoHS: Compliant; Ambient Temperature Range Low: -40°C; Ambient Temperature Range High: 100°C; Height: 8.9mm

## Nets that join several sheets
3V3_INT: ADC (10 pins), LM74910H_PINOUT (R58.2)
GND: ADC (16 pins), TCAN1146_PWR_MGMT (15 pins), LM74910H_PINOUT (15 pins), JETSON_RAW_PWR_FILTER (9 pins)
PWR_IN: TCAN1146_PWR_MGMT (F1.1), LM74910H_PINOUT (C71.1 Q7.3 U12.2), JETSON_RAW_PWR_FILTER (C75.1 C78.1 C79.1 L5.1)
PWR_OUT: TCAN1146_PWR_MGMT (U8.3 U8.4), LM74910H_PINOUT (5 pins), JETSON_RAW_PWR_FILTER (7 pins)